# Altium schematic sheet Pwr&MCU.SchDoc
size A4; SheetNumber: 1; SheetTotal: 3
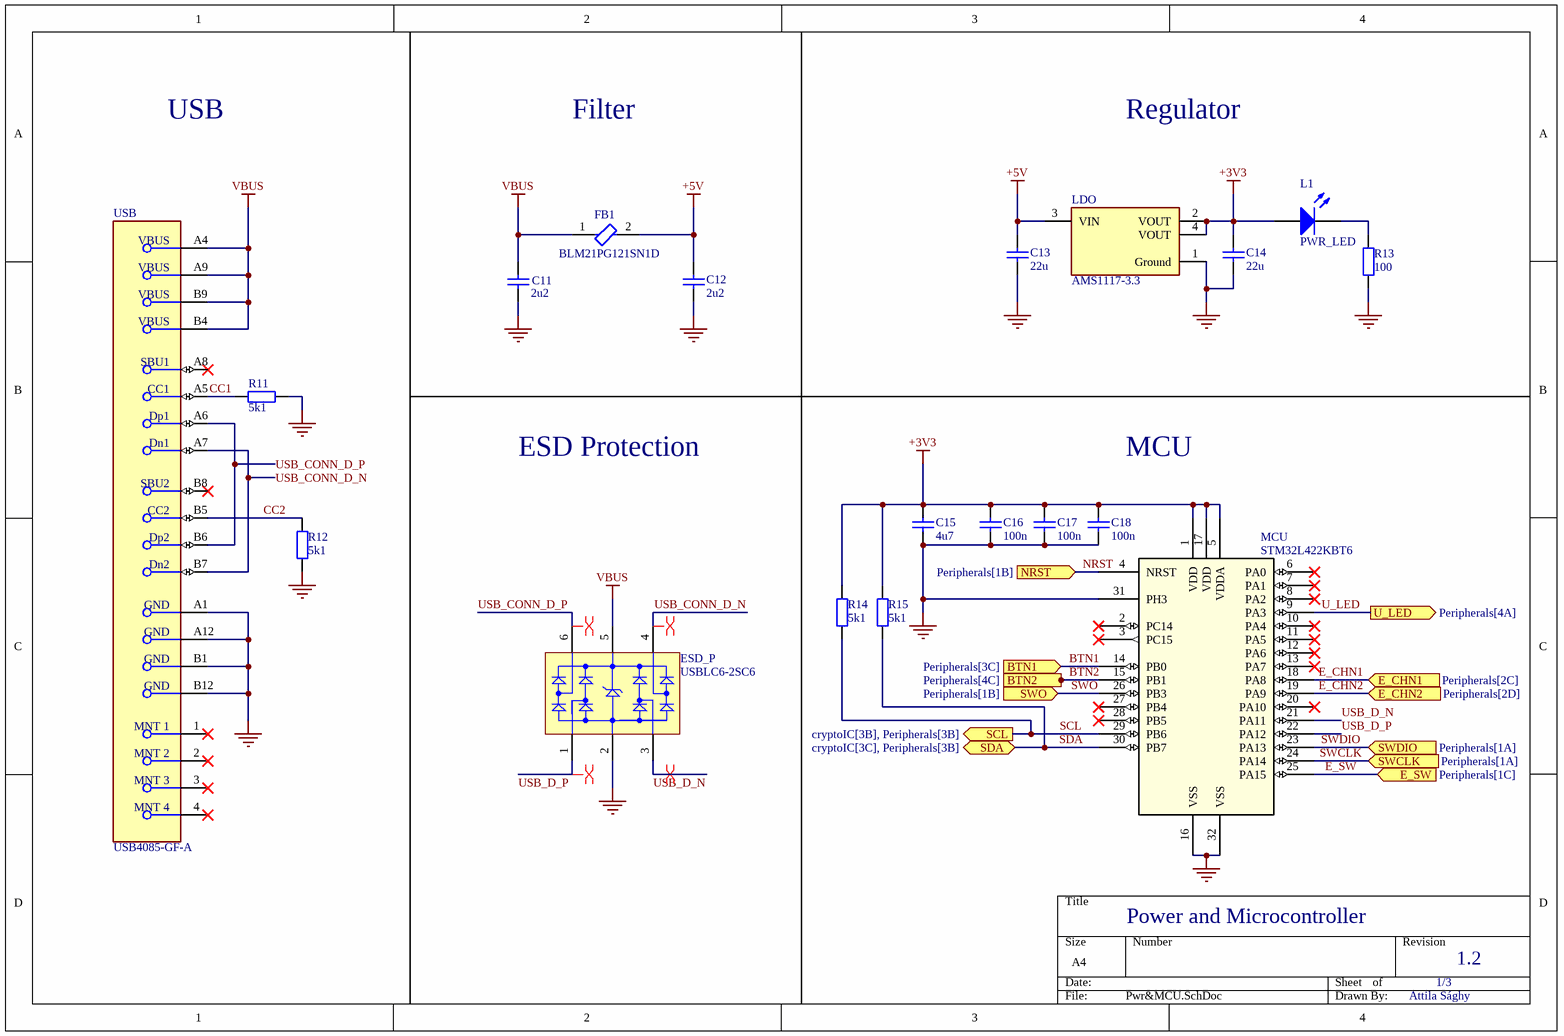
[diagram p0: Pwr&MCU.SchDoc]

## Parts
C11  2u2  [FP_0805_CAP_085]
C12  2u2  [FP_0805_CAP_085]
C13  22u  [FP_0805_CAP_085]
C14  22u  [FP_0805_CAP_085]
C15  4u7  [FP_0805_CAP_085]
C16  100n  [FP_0805_CAP_085]
C17  100n  [FP_0805_CAP_085]
C18  100n  [FP_0805_CAP_085]
ESD_P  USBLC6-2SC6  [STM-SOT23-6L_V]
FB1  BLM21PG121SN1D  [FP-BLM21-0_2-t0_85-e0_5-d-IPC_C]
L1  PWR_LED  [FP_0805_LED_RED]
LDO  AMS1117-3.3  [FP-AMS1117-IPC_C]
MCU  STM32L422KBT6  [LQFP_422KBT6_STM]
R11  5k1  [FP_0805_RES]
R12  5k1  [FP_0805_RES]
R13  100  [FP_0805_RES]
R14  5k1  [FP_0805_RES]
R15  5k1  [FP_0805_RES]
USB  USB4085-GF-A  [FP-USB4085-GF-A-MFG]

## Ports
BTN1 (in, see Peripherals[3C]), BTN2 (in, see Peripherals[4C]), E_CHN1 (in, see Peripherals[2C]), E_CHN2 (in, see Peripherals[2D]), E_SW (in, see Peripherals[1C]), NRST (in, see Peripherals[1B]), SCL (out, see cryptoIC[3B], Peripherals[3B]), SDA (bidir, see cryptoIC[3C], Peripherals[3B]), SWCLK (in, see Peripherals[1A]), SWDIO (in, see Peripherals[1A]), SWO (in, see Peripherals[1B]), U_LED (out, see Peripherals[4A])

## Nets
+3V3: C14.2 C15.2 C16.2 C17.2 C18.2 L1.1(A) LDO.2(VOUT) LDO.4(VOUT) MCU.1(VDD) MCU.5(VDDA) MCU.17(VDD) R14.2 R15.2
+5V: C12.2 C13.2 FB1.2 LDO.3(VIN)
GND: C11.1 C12.1 C13.1 C14.1 C15.1 C16.1 C17.1 C18.1 ESD_P.2(GND) LDO.1(Ground) MCU.16(VSS) MCU.31(PH3) MCU.32(VSS) R11.1 R12.2 R13.1 USB.A1(GND) USB.A12(GND) USB.B1(GND) USB.B12(GND)
VBUS: C11.2 ESD_P.5(VBUS) FB1.1 USB.A4(VBUS) USB.A9(VBUS) USB.B4(VBUS) USB.B9(VBUS)
BTN1: MCU.14(PB0) ; port BTN1
BTN2: MCU.15(PB1) ; port BTN2
CC1: R11.2 USB.A5(CC1)
CC2: R12.1 USB.B5(CC2)
E_CHN1: MCU.18(PA8) ; port E_CHN1
E_CHN2: MCU.19(PA9) ; port E_CHN2
E_SW: MCU.25(PA15) ; port E_SW
NRST: MCU.4(NRST) ; port NRST
SCL: MCU.29(PB6) R14.1 ; port SCL
SDA: MCU.30(PB7) R15.1 ; port SDA
SWCLK: MCU.24(PA14) ; port SWCLK
SWDIO: MCU.23(PA13) ; port SWDIO
SWO: MCU.26(PB3) ; port SWO
U_LED: MCU.9(PA3) ; port U_LED
USB_CONN_D_N: ESD_P.4(I/O_3) USB.A7(Dn1) USB.B7(Dn2)
USB_CONN_D_P: ESD_P.6(I/O_4) USB.A6(Dp1) USB.B6(Dp2)
USB_D_N: ESD_P.3(I/O_2) MCU.21(PA11)
USB_D_P: ESD_P.1(I/O_1) MCU.22(PA12)
NetL1_2: L1.2(K) R13.2

Not connected (* = marked no-connect by the designer): MCU 2(PC14)* 3(PC15)* 6(PA0)* 7(PA1)* 8(PA2)* 10(PA4)* 11(PA5)* 12(PA6)* 13(PA7)* 20(PA10)* 27(PB4)* 28(PB5)*; USB 1(MNT_1)* 2(MNT_2)* 3(MNT_3)* 4(MNT_4)* A8(SBU1)* B8(SBU2)*

## Layout directives
differential pair: USB_CONN_D_N, USB_CONN_D_P, USB_D_N, USB_D_P

## Notes on the sheet
- USB
- Filter
- Regulator
- ESD Protection
- MCU
- Power and Microcontroller
- 1/3
- 1.2
- Attila Sághy

## Library data of the parts
C11-C18 = CAP: Capacitor
  C11 C12: Value: 2u2
  C13 C14: Value: 22u
  C15: Value: 4u7
  C16-C18: Value: 100n
ESD_P = CMP-2000-05378-1: Very low capacitance ESD protection, 3.5 pF, -40 to 125 degC, 6-Pin SOT23, RoHS, Tape and Reel; Manufacturer: STMicroelectronics; Polarity: Uni-Directional; Clamping Voltage: 17V; Rad Hardened: No; Product Height (mm): 1.3mm; Leakage Current (Max): 0.15uA; Product Length (mm): 3.05mm; Number of Elements: 1; Peak Pulse Current: 5A; Configuration: Dual; Reverse Breakdown Voltage: 6V; Working Voltage (Max): 5V; Capacitance Value: 3.5pF; Suppressor Type: DiodeArrays; Product Depth (mm): 1.75mm; Test Current (It): 1mA; Package / Case: SOT-23; Operating Temperature Max Deg. C: 125C; Package Description: 6-Pin Small Outline Transistor, Body 2.925 x 1.625 mm, Pitch 0.95 mm; Package Reference: SOT23-6L; Datasheet Version: Rev. 5, 10/2011; Operating Temperature Min Deg. C: -40C; Mounting Style: SurfaceMount; Direction Type: Uni-Directional; Mounting: SurfaceMount; Pin Count: 6; Leakage Current: 0.15uA; Packaging: TapeandReel; Operating Temperature Classification: Automotive; Clamping Voltage (Max): 17V; Manufacturer URL: http://www.st.com/; Reverse Stand-off Voltage: 5V; Datasheet URL: http://www.st.com/st-web-ui/static/active/en/resource/technical/document/datasheet/CD00050750.pdf; Working Voltage: 5V; Operating Temp Range: -40Cto125C
FB1 = CMP-0686-00612-3: Chip Ferrite Bead, 0805, 120Ω @ 100MHz, 0.03Ω, 25%, 3A; Impedance: 120R; Number of Circuits: 1; Material: Steel; DC Resistance (DCR): 30mR; Package Quantity: 1; Lead Free: Lead Free; Width: 1.25mm; Number of Pins: 2; Depth: 1.25mm; Case Code (Imperial): 0805; Tolerance: 25%; Current Rating: 3A; Test Frequency: 100MHz; Length: 2mm; Min Operating Temperature: -55°C; Max Current Rating: 3A; REACH SVHC: No SVHC; Series: BLM21P; Height: 0.85mm; Max DC Current: 3A; Termination: SMD/SMT; Max Operating Temperature: 125°C; Number of Lines: 1; Case/Package: 0805; RoHS Compliant: Yes; Packaging: Tape and Reel; Case Code (Metric): 2012; DC Resistance-Max: 30mR
L1 = LED: Typical RED GaAs LED; pin to pad: 1>A 2>K
LDO = CMP-209535-000001-1: LDO Voltage Regulators 1A, 3.3V; Manufacturer: Advanced Monolithic Systems; Dropout Voltage: 1.1V; Output Type: Fixed; Nominal Supply Current: 5mA; Max Power Dissipation: 1.2W; Max Supply Voltage: 15V; Number Of Outputs: 1; Standoff Height: 0.64mm; Max Junction Temp: +125°C; Height: 1.8mm; Package: AMS1117; Device Class L2: Power Management ICs; ComponentLink2Description: Datasheet; ComponentLink2URL: http://www.advanced-monolithic.com/pdf/ds1117.pdf; Category: IC; RoHS: TRUE; Automotive: No; Device Class L1: Integrated Circuits (ICs); Output Current: 1A; Device Class L3: Voltage Regulators - Linear; Temperature: -40°C to +125°C; Output Voltage: 3.3V; Manufacturer Part Number: AMS1117-3.3; Temperature Range Low: -40°C; Octopart: https://octopart.com/ams1117-3.3-advanced+monolithic+systems-25899300; Lead Free: Yes; Ipc Land Pattern Name: SOT229P700X180-4; Temperature Range High: +125°C
MCU = STM32L422KBT6: No Description Available; Mfr_Name: STMicroelectronics; Copyright: Copyright (C) 2023 Ultra Librarian. All rights reserved.; Manufacturer_Part_Number: STM32L422KBT6; RefDes: RefDes; Type: DEV
R11-R15 = RES: Resistor
  R11 R12 R14 R15: Value: 5k1
  R13: Value: 100
USB = CMP-196119-000001-2: CONN RCPT USB2.0 TYPE C 24POS RA; Gender: Receptacle; Number of Positions: 16; USB Standard: USB 2.0; Orientation: Right Angle; Contact Plating: Gold; Contact Material: Copper Alloy